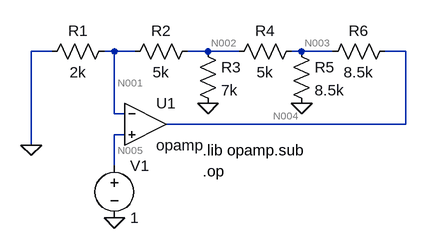
[diagram p0: schematic pag8es19.asc]
pag8es19.asc, the LTspice schematic file:
Version 4
SHEET 1 880 680
WIRE 0 64 -32 64
WIRE 96 64 80 64
WIRE 128 64 96 64
WIRE 240 64 208 64
WIRE 288 64 240 64
WIRE 384 64 368 64
WIRE 432 64 384 64
WIRE 544 64 512 64
WIRE 96 160 96 64
WIRE 112 160 96 160
WIRE 544 176 544 64
WIRE 544 176 176 176
WIRE 112 192 96 192
WIRE -32 208 -32 64
WIRE 96 240 96 192
FLAG -32 208 0
FLAG 96 320 0
FLAG 240 144 0
FLAG 384 144 0
SYMBOL res 96 48 R90
WINDOW 0 0 56 VBottom 2
WINDOW 3 32 56 VTop 2
SYMATTR InstName R1
SYMATTR Value 2k
SYMBOL OpAmps\\opamp 144 112 R0
SYMATTR InstName U1
SYMBOL voltage 96 224 R0
SYMATTR InstName V1
SYMATTR Value 1
SYMBOL res 224 48 R90
WINDOW 0 0 56 VBottom 2
WINDOW 3 32 56 VTop 2
SYMATTR InstName R2
SYMATTR Value 5k
SYMBOL res 224 48 R0
SYMATTR InstName R3
SYMATTR Value 7k
SYMBOL res 384 48 R90
WINDOW 0 0 56 VBottom 2
WINDOW 3 32 56 VTop 2
SYMATTR InstName R4
SYMATTR Value 5k
SYMBOL res 368 48 R0
SYMATTR InstName R5
SYMATTR Value 8.5k
SYMBOL res 528 48 R90
WINDOW 0 0 56 VBottom 2
WINDOW 3 32 56 VTop 2
SYMATTR InstName R6
SYMATTR Value 8.5k
TEXT 232 216 Left 2 !.lib opamp.sub
TEXT 232 248 Left 2 !.op

The netlist it stands for:
* pag8es19.asc
R1 N001 0 2k
XU1 N001 N005 N004 opamp Aol=100K GBW=10Meg  ; pins invin noninvin out
V1 N005 0 1
R2 N002 N001 5k
R3 N002 0 7k
R4 N003 N002 5k
R5 N003 0 8.5k
R6 N004 N003 8.5k
.lib opamp.sub
.op
.backanno
.end

* Results of the author's LTspice run, read from the files saved beside the schematic
* Operating Point:
*   V(n001) = 999.7 mV
*   V(n004) = 25.49 V
*   V(n005) = 1 V
*   V(n002) = 3.499 V
*   V(n003) = 8.498 V
*   I(R6) = 1.999 mA
*   I(R5) = 999.7 µA
*   I(R4) = 999.7 µA
*   I(R3) = 499.9 µA
*   I(R2) = 499.9 µA
*   I(R1) = 499.9 µA
*   I(V1) = 0 A
*   Ix(u1:3) = -1.999 mA